# EAGLE board slaveV10a (EAGLE 6.1)
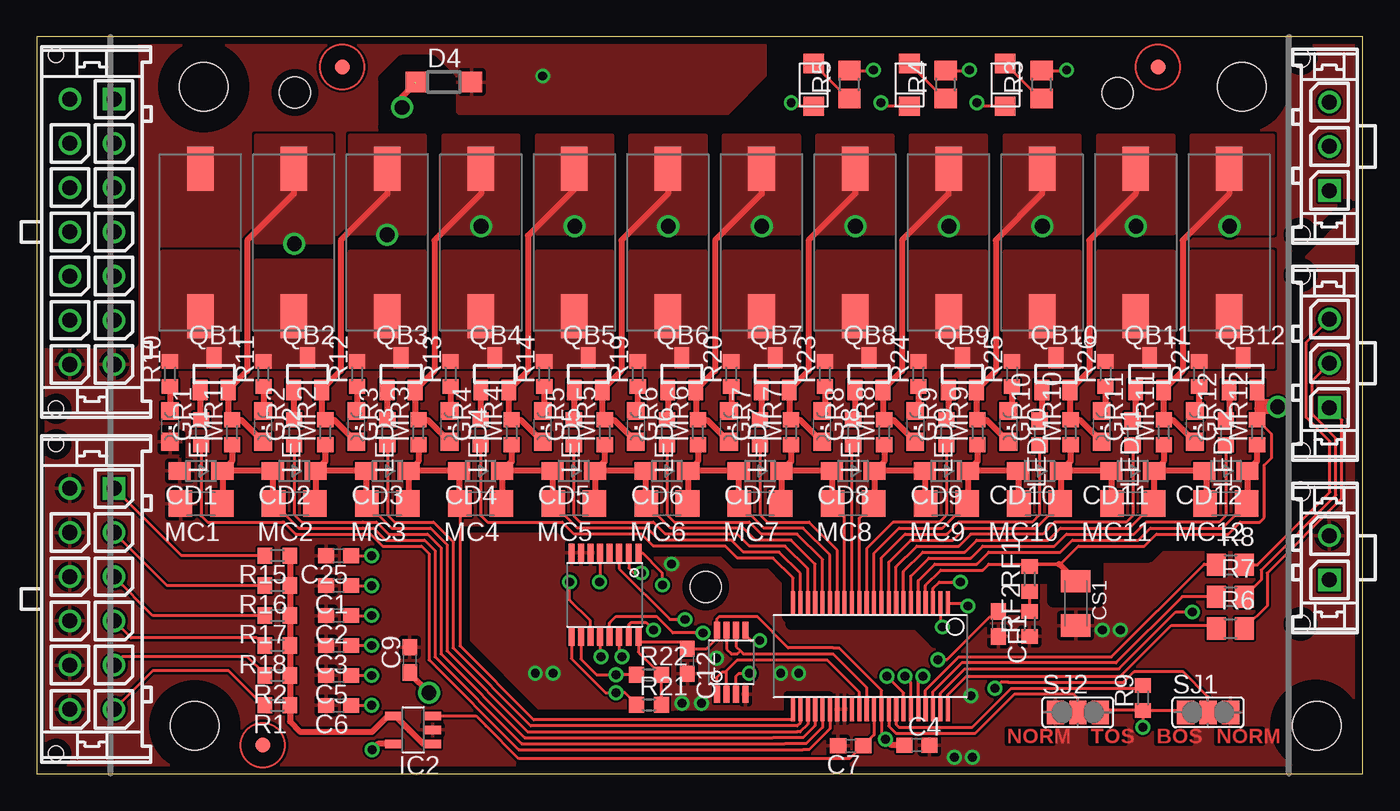
[diagram p3: board, top side]
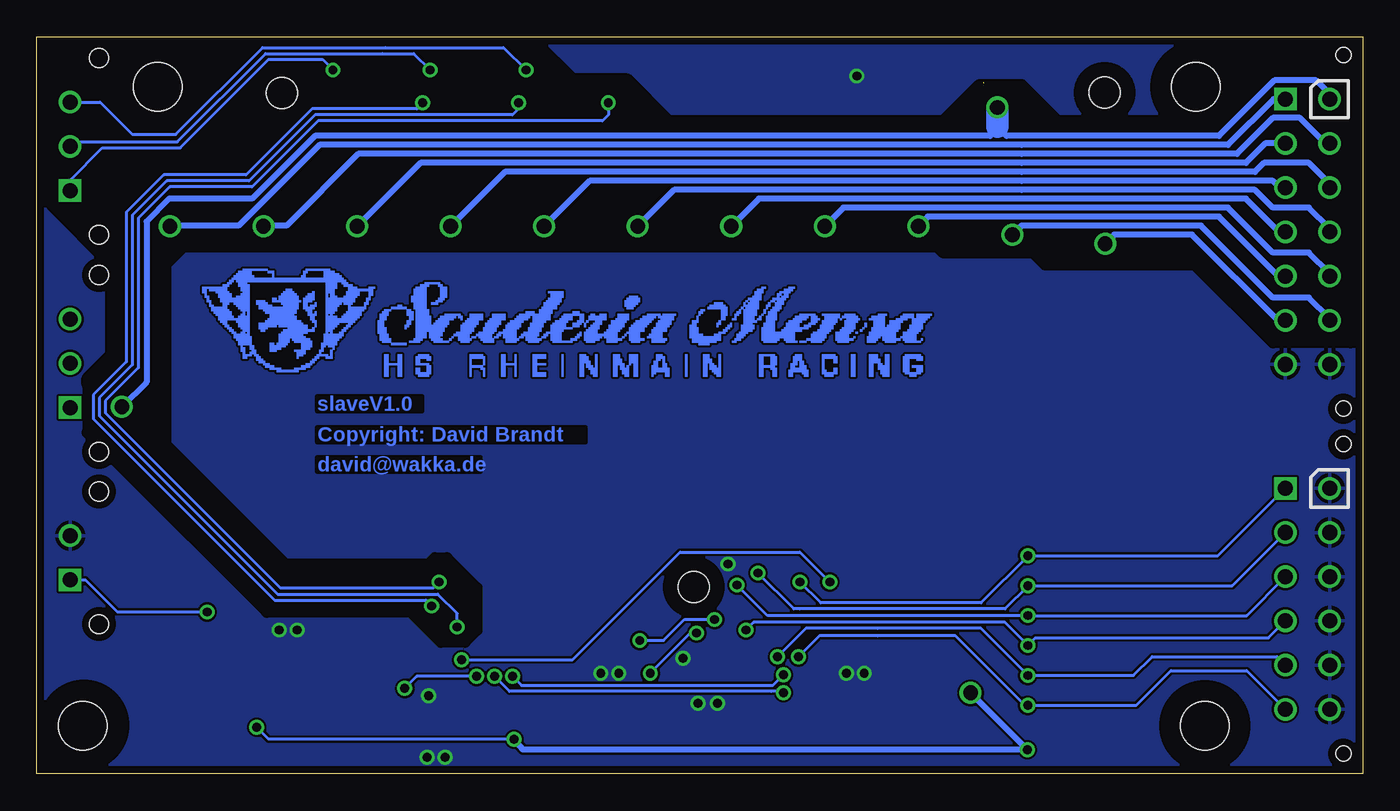
[diagram p4: board, bottom side, seen from below]

Size 90 x 50 mm. Coordinates in mm from the lower left corner, seen from the top.
Outline: 0,0 90,0 90,50 0,50 0,0
Copper layers (1*16): Top 0.035mm / dielectric 1.5mm / Bottom 0.035mm
Design rules: minimum track width 8mil, minimum drill 0.6mm, track to track 6mil, track to pad 6mil, pad to pad 6mil, via to via 6mil, smd to smd 0mil, copper to edge 20mil, drill to drill 10mil, minimum pad ring 8mil, minimum via ring 8mil, stop-mask expansion 0mil, vias tented up to drill 0mil, thermal gap 10mil
Holes 3.3 mm at 11.33,46.61 10.72,3.25 81.8,46.61 86.88,3.25
Holes 2.1 mm at 73.36,46.2 17.52,46.21 45.41,12.67
tRestrict: area 7.7,0.3 to 13.7,6.3; area 8.3,43.6 to 14.3,49.6; area 71.9,44.7 to 74.9,47.7; area 16,44.7 to 19,47.7; area 78.9,43.6 to 84.9,49.6; area 83.8,0.3 to 89.8,6.3; area 43.9,11.2 to 46.9,14.2; 59 lines
bRestrict: area 7.7,0.3 to 13.7,6.3; area 8.3,43.6 to 14.3,49.6; area 71.4,44.2 to 75.4,48.2; area 15.5,44.2 to 19.5,48.2; area 78.9,43.6 to 84.9,49.6; area 83.8,0.3 to 89.8,6.3; area 43.4,10.7 to 47.4,14.7; 35 lines

## Footprints (pad centres in the part's own frame; a part is rotated, then mirrored left to right if it is on the bottom)
C0603 = smd 1.1 x 1: 1 -0.85,0; 2 0.85,0
SOD323-W = smd 1.5 x 1.2: A 1.45,0; C -1.45,0
C1206K = smd 1.5 x 2: 1 -1.5,0; 2 1.5,0
DO-219AB = smd 1.3 x 1.4: A -1.45,0; C 1.45,0
SOD123 = smd 1.4 x 1.4: A 1.9,0; C -1.9,0
R0603 = smd 1 x 1.1: 1 -0.85,0; 2 0.85,0
44SSOP = smd 1.6 x 0.28: 1 -3.6,5.25; 2 -3.6,4.75; 3 -3.6,4.25; 4 -3.6,3.75; 5 -3.6,3.25; 6 -3.6,2.75; 7 -3.6,2.25; 8 -3.6,1.75; 9 -3.6,1.25; 10 -3.6,0.75; 11 -3.6,0.25; 12 -3.6,-0.25; 13 -3.6,-0.75; 14 -3.6,-1.25; 15 -3.6,-1.75; 16 -3.6,-2.25; 17 -3.6,-2.75; 18 -3.6,-3.25; 19 -3.6,-3.75; 20 -3.6,-4.25; 21 -3.6,-4.75; 22 -3.6,-5.25; 23 3.6,-5.25; 24 3.6,-4.75; 25 3.6,-4.25; 26 3.6,-3.75; 27 3.6,-3.25; 28 3.6,-2.75; 29 3.6,-2.25; 30 3.6,-1.75; 31 3.6,-1.25; 32 3.6,-0.75; 33 3.6,-0.25; 34 3.6,0.25; 35 3.6,0.75; 36 3.6,1.25; 37 3.6,1.75; 38 3.6,2.25; 39 3.6,2.75; 40 3.6,3.25; 41 3.6,3.75; 42 3.6,4.25; 43 3.6,4.75; 44 3.6,5.25
SOT23-5 = smd 0.6 x 1.2: 1 -0.95,-1.306; 2 0,-1.306; 3 0.95,-1.306; 4 0.95,1.306; 5 -0.95,1.306
MS8 = smd 1.156 x 0.406: 1 -2.183,0.975; 2 -2.183,0.325; 3 -2.183,-0.325; 4 -2.183,-0.975; 5 2.183,-0.975; 6 2.183,-0.325; 7 2.183,0.325; 8 2.183,0.975
TSSOP16 = smd 1.25 x 0.406: 1 -2.845,2.275; 2 -2.845,1.625; 3 -2.845,0.975; 4 -2.845,0.325; 5 -2.845,-0.325; 6 -2.845,-0.975; 7 -2.845,-1.625; 8 -2.845,-2.275; 9 2.845,-2.275; 10 2.845,-1.625; 11 2.845,-0.975; 12 2.845,-0.325; 13 2.845,0.325; 14 2.845,0.975; 15 2.845,1.625; 16 2.845,2.275
CHIPLED_0805 = smd 1.2 x 1.2: A 0,-1.05; C 0,1.05
C1206 = smd 1.6 x 1.8: 1 -1.4,0; 2 1.4,0
SUPER-SOT3 = smd 1 x 1.4: 1 -0.95,-1.1; 2 0.95,-1.1; 3 0,1.1
R0805 = smd 1.3 x 1.5: 1 -0.95,0; 2 0.95,0
FIDUCIA-MOUNT = smd 1.016 x 1.016: P$1 0,0
SM_3 = smd 1.8 x 3: P$1 0,5; P$2 0,-5
SJ_2 = smd 1.168 x 1.6: 1 -1.524,0; 2 0,0; 3 1.524,0
43650-0315 = drill 1.02 square: 1 3,0 | drill 1.02: 2 0,0; 3 -3,0 | hole 1.27: 6,-1.96; -6,-1.96
43650-0215 = drill 1.02 square: 1 1.5,0 | drill 1.02: 2 -1.5,0 | hole 1.27: 4.5,-1.96; -4.5,-1.96
43045-1212 = drill 1.02 square: P$1 7.5,0 | drill 1.02: P$2 4.5,0; P$3 1.5,0; P$4 -1.5,0; P$5 -4.5,0; P$6 -7.5,0; P$7 7.5,3; P$8 4.5,3; P$9 1.5,3; P$10 -1.5,3; P$11 -4.5,3; P$12 -7.5,3 | hole 1.02: 10.5,3.94; -10.5,3.94
43045-1412 = drill 1.02 square: P$1 9,0 | drill 1.02: P$2 6,0; P$3 3,0; P$4 0,0; P$5 -3,0; P$6 -6,0; P$7 -9,0; P$8 9,3; P$9 6,3; P$10 3,3; P$11 0,3; P$12 -3,3; P$13 -6,3; P$14 -9,3 | hole 1.02: 12,3.94; -12,3.94

## Placement (x,y rotation side)
C1  1u  [C0603]  20.49,12.76 180 top
C2  1u  [C0603]  20.49,10.73 180 top
C3  1u  [C0603]  20.49,8.7 180 top
C4  1u  [C0603]  59.74,1.93 0 top
C5  1u  [C0603]  20.49,6.67 180 top
C6  1u  [C0603]  20.49,4.64 180 top
C7  1u  [C0603]  55.24,1.89 180 top
C9  1u  [C0603]  25.32,7.72 90 top
C12  1u  [C0603]  44.15,7.63 270 top
C25  1u  [C0603]  20.49,14.8 180 top
CD1  7.5  [SOD323-W]  11.15,20.54 180 top
CD2  7.5  [SOD323-W]  17.47,20.54 180 top
CD3  7.5  [SOD323-W]  23.8,20.54 180 top
CD4  7.5  [SOD323-W]  30.12,20.54 180 top
CD5  7.5  [SOD323-W]  36.45,20.54 180 top
CD6  7.5  [SOD323-W]  42.77,20.54 180 top
CD7  7.5  [SOD323-W]  49.09,20.54 180 top
CD8  7.5  [SOD323-W]  55.42,20.54 180 top
CD9  7.5  [SOD323-W]  61.74,20.54 180 top
CD10  7.5  [SOD323-W]  68.06,20.54 180 top
CD11  7.5  [SOD323-W]  74.39,20.54 180 top
CD12  7.5  [SOD323-W]  80.71,20.54 180 top
CF1  1u  [C0603]  65.28,10.16 270 top
CS1  1u100v  [C1206K]  70.53,11.55 270 top
D1  RS07J  [DO-219AB]  65.74,46.74 270 top
D2  RS07J  [DO-219AB]  59.23,46.74 270 top
D3  RS07J  [DO-219AB]  52.73,46.74 270 top
D4  52V  [SOD123]  27.62,46.93 0 top
GR1  3.3k  [R0603]  11.15,23.16 90 top
GR2  3.3k  [R0603]  17.47,23.16 90 top
GR3  3.3k  [R0603]  23.8,23.16 90 top
GR4  3.3k  [R0603]  30.12,23.16 90 top
GR5  3.3k  [R0603]  36.45,23.16 90 top
GR6  3.3k  [R0603]  42.77,23.16 90 top
GR7  3.3k  [R0603]  49.09,23.16 90 top
GR8  3.3k  [R0603]  55.42,23.16 90 top
GR9  3.3k  [R0603]  61.74,23.16 90 top
GR10  3.3k  [R0603]  68.06,23.16 90 top
GR11  3.3k  [R0603]  74.39,23.16 90 top
GR12  3.3k  [R0603]  80.71,23.16 90 top
IC1  LTC6803-3  [44SSOP]  56.58,7.97 270 top
IC2  LT1782  [SOT23-5]  25.55,2.97 90 top
IC3  LT6001  [MS8]  47.14,7.57 90 top
IC4  4052TSSOP  [TSSOP16]  38.56,12.14 270 top
LED1  [CHIPLED_0805]  9.04,23.57 180 top
LED2  [CHIPLED_0805]  15.37,23.57 180 top
LED3  [CHIPLED_0805]  21.69,23.57 180 top
LED4  [CHIPLED_0805]  28.01,23.57 180 top
LED5  [CHIPLED_0805]  34.34,23.57 180 top
LED6  [CHIPLED_0805]  40.66,23.57 180 top
LED7  [CHIPLED_0805]  46.99,23.57 180 top
LED8  [CHIPLED_0805]  53.31,23.57 180 top
LED9  [CHIPLED_0805]  59.63,23.57 180 top
LED10  [CHIPLED_0805]  65.96,23.57 180 top
LED11  [CHIPLED_0805]  72.28,23.57 180 top
LED12  [CHIPLED_0805]  78.6,23.57 180 top
MC1  100n  [C1206]  11.15,18.32 180 top
MC2  100n  [C1206]  17.47,18.32 180 top
MC3  100n  [C1206]  23.8,18.32 180 top
MC4  100n  [C1206]  30.12,18.32 180 top
MC5  100n  [C1206]  36.45,18.32 180 top
MC6  100n  [C1206]  42.77,18.32 180 top
MC7  100n  [C1206]  49.09,18.32 180 top
MC8  100n  [C1206]  55.42,18.32 180 top
MC9  100n  [C1206]  61.74,18.32 180 top
MC10  100n  [C1206]  68.06,18.32 180 top
MC11  100n  [C1206]  74.39,18.32 180 top
MC12  100n  [C1206]  80.71,18.32 180 top
MR1  100  [R0603]  13.26,23.16 90 top
MR2  100  [R0603]  19.58,23.16 90 top
MR3  100  [R0603]  25.91,23.16 90 top
MR4  100  [R0603]  32.23,23.16 90 top
MR5  100  [R0603]  38.55,23.16 90 top
MR6  100  [R0603]  44.88,23.16 90 top
MR7  100  [R0603]  51.2,23.16 90 top
MR8  100  [R0603]  57.52,23.16 90 top
MR9  100  [R0603]  63.85,23.16 90 top
MR10  100  [R0603]  70.17,23.16 90 top
MR11  100  [R0603]  76.5,23.16 90 top
MR12  100  [R0603]  82.83,23.16 90 top
QB1  PMV65XP  [SUPER-SOT3]  12.03,27.13 0 top
QB2  PMV65XP  [SUPER-SOT3]  18.38,27.13 0 top
QB3  PMV65XP  [SUPER-SOT3]  24.73,27.13 0 top
QB4  PMV65XP  [SUPER-SOT3]  31.08,27.13 0 top
QB5  PMV65XP  [SUPER-SOT3]  37.43,27.13 0 top
QB6  PMV65XP  [SUPER-SOT3]  43.78,27.13 0 top
QB7  PMV65XP  [SUPER-SOT3]  50.13,27.13 0 top
QB8  PMV65XP  [SUPER-SOT3]  56.48,27.13 0 top
QB9  PMV65XP  [SUPER-SOT3]  62.83,27.13 0 top
QB10  PMV65XP  [SUPER-SOT3]  69.18,27.13 0 top
QB11  PMV65XP  [SUPER-SOT3]  75.53,27.13 0 top
QB12  PMV65XP  [SUPER-SOT3]  81.88,27.13 0 top
R1  10k0.1%  [R0603]  16.33,4.64 180 top
R2  10k0.1%  [R0603]  16.33,6.67 180 top
R3  100  [R0805]  68.21,46.77 90 top
R4  20  [R0805]  61.69,46.77 90 top
R5  100  [R0805]  55.17,46.77 90 top
R6  100  [R0805]  81.03,9.86 0 top
R7  20  [R0805]  81.03,12.01 0 top
R8  100  [R0805]  81.03,14.17 0 top
R9  1M  [R0603]  75.08,5.14 90 top
R10  470  [R0603]  9.04,27.13 90 top
R11  470  [R0603]  15.39,27.13 90 top
R12  470  [R0603]  21.74,27.13 90 top
R13  470  [R0603]  28.09,27.13 90 top
R14  470  [R0603]  34.44,27.13 90 top
R15  10k0.1%  [R0603]  16.33,14.8 180 top
R16  10k0.1%  [R0603]  16.33,12.76 180 top
R17  10k0.1%  [R0603]  16.33,10.73 180 top
R18  10k0.1%  [R0603]  16.33,8.7 180 top
R19  470  [R0603]  40.79,27.13 90 top
R20  470  [R0603]  47.14,27.13 90 top
R21  47k  [R0603]  41.55,4.67 0 top
R22  47k  [R0603]  41.55,6.71 0 top
R23  470  [R0603]  53.49,27.13 90 top
R24  470  [R0603]  59.84,27.13 90 top
R25  470  [R0603]  66.19,27.13 90 top
R26  470  [R0603]  72.54,27.13 90 top
R27  470  [R0603]  78.89,27.13 90 top
REF1  FIDUCIALMOUNT  [FIDUCIA-MOUNT]  20.73,47.96 0 top
REF2  FIDUCIALMOUNT  [FIDUCIA-MOUNT]  76.1,47.96 0 top
REF3  FIDUCIALMOUNT  [FIDUCIA-MOUNT]  15.34,1.93 0 top
RF1  332k0.1%  [R0603]  67.39,13.21 90 top
RF2  20k0.1%  [R0603]  67.39,10.16 90 top
RP1  10  [SM_3]  11.09,36.04 0 top
RP2  10  [SM_3]  17.44,36.04 0 top
RP3  10  [SM_3]  23.79,36.04 0 top
RP4  10  [SM_3]  30.14,36.04 0 top
RP5  10  [SM_3]  36.49,36.04 0 top
RP6  10  [SM_3]  42.84,36.04 0 top
RP7  10  [SM_3]  49.19,36.04 0 top
RP8  10  [SM_3]  55.54,36.04 0 top
RP9  10  [SM_3]  61.89,36.04 0 top
RP10  10  [SM_3]  68.24,36.04 0 top
RP11  10  [SM_3]  74.59,36.04 0 top
RP12  10  [SM_3]  80.94,36.04 0 top
SJ1  [SJ_2]  79.5,4.17 0 top
SJ2  [SJ_2]  70.66,4.17 0 top
U$7  [SMLOGO]  67.87,30.07 0 bottom
X1  [43650-0315]  87.74,42.57 270 top
X2  [43650-0315]  87.74,27.84 270 top
X3  [43650-0215]  87.74,14.65 270 top
X4  [43045-1212]  5.25,11.87 90 top
X5  [43045-1412]  5.25,36.77 90 top

## Tracks (layer width: path | path; a pad name or v marks a point on that pad's centre or on a via)
+5V  (via drill 0.6, 1)
  Top 0.203: 57.33,2.57 IC1.35 57.33,5.66 55.27,7.72 54.46,8.53 54.05,8.53 51,8.53 48.87,10.67 48.77,10.67 46.33,10.67 46.17,10.51 IC3.8 46.17,9.19 45.92,8.94 45.47,8.48 C12.1 43.7,8.94 40.84,8.94 40.84,9.04 40.95,9.14 40.83,9.26 IC4.16 40.83,8.24 40.95,8.13 42.37,6.71 R22.2 R21.2 | 57.33,2.57 v57.61,2.34 57.33,2.57 | R9.1 77.85,4.29 SJ1.1 | R9.1 72.31,4.29 SJ2.3 | R9.1 v75.08,3.15
  Top 0.406: IC2.5 23.15,2.02 v22.76,1.63 | C9.1 25.32,6.79 v26.62,5.49 | C4.1 58.01,1.93 v57.61,2.34
  Bottom 0.203: v57.61,2.34 70.81,2.34 74.27,2.34 v75.08,3.15
  Bottom 0.406: v26.62,5.49 v22.76,1.63 57,1.63 v57.61,2.34
B1
  pour Top (no thermals): 8.55,35.41 8.55,27.6 13.63,27.6 13.63,35.41
B2
  pour Top (no thermals): 14.9,34.8 14.9,27.6 19.98,27.6 19.98,34.8
B3
  pour Top (no thermals): 21.25,35.41 21.25,27.6 26.33,27.6 26.33,35.41
B4
  pour Top (no thermals): 27.6,35.41 27.6,27.6 32.68,27.6 32.68,35.41
B5
  pour Top (no thermals): 33.95,35.41 33.95,27.6 39.03,27.6 39.03,35.41
B6
  pour Top (no thermals): 40.3,35.41 40.3,27.6 45.38,27.6 45.38,35.41
B7
  pour Top (no thermals): 46.65,35.41 46.65,27.6 51.73,27.6 51.73,35.41
B8
  pour Top (no thermals): 53,35.41 53,27.6 58.08,27.6 58.08,35.41
B9
  pour Top (no thermals): 59.35,35.41 59.35,27.6 64.43,27.6 64.43,35.41
B10
  pour Top (no thermals): 65.7,35.41 65.7,27.6 70.78,27.6 70.78,35.41
B11
  pour Top (no thermals): 72.05,35.41 72.05,27.6 77.13,27.6 77.13,35.41
B12
  pour Top (no thermals): 78.4,35.41 78.4,27.6 83.89,27.6 83.89,35.41
C1  (via drill 1)
  Top 0.406: RP2.P$1 17.44,39.35 14.29,36.2 14.29,27.33 QB1.2 12.98,24.29 MR1.2 13.87,24.02 LED2.C
  Bottom 0.406: X5.P$6 5.77,30.77 11.58,36.58 16.87,36.58 v17.48,35.97
  pour Top (no thermals): 14.9,43.28 14.9,36.07 19.98,36.07 19.98,43.28
C1M
  Top 0.203: MC2.2 16.07,18.27 16.18,18.27 17.78,16.66 22.15,16.66 22.86,16.66 23.67,15.85 26.31,15.85 27.03,15.14 27.03,7.92 32.92,2.03 50.8,2.03 52.22,2.03 53.33,3.14 IC1.27
  Top 0.406: MR1.1 13.26,21.2 CD1.C | CD1.C 12.6,18.37 MC1.1 | MC2.2 16.02,18.37 CD2.A CD1.C
C2  (via drill 1)
  Top 0.406: RP3.P$1 23.79,39.35 20.64,36.2 20.64,27.33 QB2.2 19.33,24.27 MR2.2 20.2,24.02 LED3.C
  Bottom 0.406: X5.P$13 2.25,30.9 3.66,32.31 6.1,32.31 10.97,37.19 17.68,37.19 23.16,37.19 v23.77,36.58
  pour Top (no thermals): 21.25,43.28 21.25,36.68 26.33,36.68 26.33,43.28
C2M
  Top 0.203: MC3.2 22.42,18.32 24.08,16.66 26.72,16.66 27.84,15.54 27.84,8.33 33.33,2.85 51.61,2.85 51.82,2.85 52.33,3.36 IC1.25
  Top 0.406: MR2.1 19.58,21.2 CD2.C | CD2.C 18.92,18.37 MC2.1 | CD2.C CD3.A 22.35,18.37 MC3.2
C3  (via drill 1)
  Top 0.406: RP4.P$1 30.14,39.35 26.99,36.2 26.99,27.33 QB3.2 25.68,24.24 MR3.2 26.52,24.02 LED4.C
  Bottom 0.406: X5.P$5 5.72,33.77 9.75,37.8 24.99,37.8 29.52,37.8 v30.16,37.15
  pour Top (no thermals): 27.6,43.28 27.6,36.68 32.68,36.68 32.68,43.28
C3M
  Top 0.203: MC4.2 28.72,8.67 33.73,3.66 51.21,3.66 51.33,3.79 IC1.23
  Top 0.406: CD3.C CD4.A 28.67,18.37 MC4.2 | MR3.1 25.91,21.2 CD3.C | CD3.C 25.25,18.37 MC3.1
C4  (via drill 1)
  Top 0.406: RP5.P$1 36.49,39.67 33.34,36.51 33.34,27.33 QB4.2 32.03,24.21 MR4.2 32.84,24.02 LED5.C
  Bottom 0.406: X5.P$12 2.25,33.95 3.66,35.36 6.1,35.36 9.14,38.41 23.16,38.41 35.26,38.41 v36.51,37.15
  pour Top (no thermals): 33.95,43.28 33.95,36.68 39.03,36.68 39.03,43.28
C4M
  Top 0.203: IC1.21 51.83,13.6 50.39,15.04 47.95,15.04 47.14,15.85 42.27,15.85 41.45,16.66 36.7,16.66 MC5.2
  Top 0.406: CD4.C 31.57,18.37 MC4.1 | MR4.1 32.23,21.2 CD4.C | CD4.C CD5.A 35,18.37 MC5.2
C5  (via drill 1)
  Top 0.406: RP6.P$1 42.84,39.35 39.69,36.2 39.69,27.33 QB5.2 38.38,24.19 MR5.2 39.17,24.02 LED6.C
  Bottom 0.406: X5.P$4 5.68,36.77 7.92,39.01 23.16,39.01 41,39.01 v42.86,37.15
  pour Top (no thermals): 40.3,43.28 40.3,36.68 45.38,36.68 45.38,43.28
C5M
  Top 0.203: IC1.19 52.83,14.22 51.21,15.85 48.77,15.85 47.95,16.66 43.02,16.66 MC6.2
  Top 0.406: MR5.1 38.55,21.2 CD5.C | CD5.C 37.9,18.37 MC5.1 | MC6.2 41.32,18.37 CD6.A CD5.C
C6  (via drill 1)
  Top 0.406: RP7.P$1 49.19,39.35 46.04,36.2 46.04,27.33 QB6.2 44.73,24.16 MR6.2 45.49,24.02 LED7.C
  Bottom 0.406: X5.P$11 2.25,36.99 3.66,38.41 6.1,38.41 7.32,39.62 23.16,39.62 46.74,39.62 v49.21,37.15
  pour Top (no thermals): 46.65,43.28 46.65,36.68 51.73,36.68 51.73,43.28
C6M
  Top 0.203: IC1.17 53.83,14.85 52.02,16.66 49.35,16.66 MC7.2
  Top 0.406: CD6.C 44.22,18.37 MC6.1 | MR6.1 44.88,21.2 CD6.C | CD6.C CD7.A 47.64,18.37 MC7.2
C7  (via drill 1)
  Top 0.406: RP8.P$1 55.54,39.35 52.39,36.2 52.39,27.33 QB7.2 51.08,24.14 MR7.2 51.81,24.02 LED8.C
  Bottom 0.406: X5.P$3 5.63,39.77 6.1,40.23 23.16,40.23 52.48,40.23 v55.56,37.15
  pour Top (no thermals): 53,43.28 53,36.68 58.08,36.68 58.08,43.28
C7M
  Top 0.203: IC1.15 54.83,17.5 MC8.2
  Top 0.406: CD7.C 50.54,18.37 MC7.1 | MR7.1 51.2,21.2 CD7.C | CD7.C CD8.A 53.97,18.37 MC8.2
C8  (via drill 1)
  Top 0.406: RP9.P$1 61.89,39.35 58.74,36.2 58.74,27.33 QB8.2 57.43,24.11 MR8.2 58.14,24.02 LED9.C
  Bottom 0.406: X5.P$10 2.25,40.04 3.66,41.45 6.71,41.45 7.32,40.84 23.16,40.84 58.22,40.84 v61.91,37.15
  pour Top (no thermals): 59.35,43.28 59.35,36.68 64.43,36.68 64.43,43.28
C8M
  Top 0.203: IC1.13 55.83,17.34 MC8.1
  Top 0.406: MR8.1 57.52,21.2 CD8.C | CD8.C 56.87,18.37 MC8.1 | CD8.C CD9.A 60.29,18.37 MC9.2
C9  (via drill 1)
  Top 0.406: RP10.P$1 68.24,39.35 65.09,36.2 65.09,27.33 QB9.2 63.78,24.08 MR9.2 64.46,24.02 LED10.C
  Bottom 0.406: X5.P$2 6.61,42.77 7.92,41.45 23.16,41.45 63.96,41.45 v68.26,37.15
  pour Top (no thermals): 65.7,43.28 65.7,36.68 70.78,36.68 70.78,43.28
C9M
  Top 0.203: IC1.11 56.83,14.97 58.52,16.66 61.48,16.66 MC9.1
  Top 0.406: CD9.C 63.19,18.37 MC9.1 | MR9.1 63.85,21.2 CD9.C | CD9.C CD10.A 66.61,18.37 MC10.2
C10  (via drill 1)
  Top 0.406: RP11.P$1 74.59,39.35 71.44,36.2 71.44,27.33 QB10.2 70.13,24.06 MR10.2 70.79,24.02 LED11.C
  Bottom 0.406: X5.P$9 2.53,42.77 3.66,43.89 4.27,44.5 6.1,44.5 8.53,42.06 23.16,42.06 68.17,42.06 73.05,37.19 74.57,37.19 v74.61,37.15
  pour Top (no thermals): 72.05,43.28 72.05,36.68 77.13,36.68 77.13,43.28
C10M
  Top 0.203: IC1.9 57.83,14.35 59.33,15.85 62.18,15.85 62.99,16.66 67.81,16.66 MC10.1
  Top 0.406: MR10.1 70.17,21.2 CD10.C | CD10.C CD11.A 72.94,18.37 MC11.2 | CD10.C 69.51,18.37 MC10.1
C11  (via drill 1)
  Top 0.406: RP12.P$1 80.94,39.35 77.79,36.2 77.79,27.33 QB11.2 76.48,24.03 MR11.2 77.11,24.02 LED12.C
  Bottom 0.406: X5.P$1 6.05,45.77 9.14,42.67 23.16,42.67 70.81,42.67 76.3,37.19 80.92,37.19 v80.96,37.15
  pour Top (no thermals): 78.4,43.28 78.4,36.68 83.89,36.68 83.89,43.28
C11M
  Top 0.203: IC1.7 58.83,13.72 60.15,15.04 62.99,15.04 63.8,15.85 68.68,15.85 69.49,16.66 74.17,16.66 74.88,17.37 75.79,18.28 MC11.1
  Top 0.406: MR11.1 76.5,21.2 CD11.C | CD11.C 75.84,18.37 MC11.1 | CD11.C CD12.A 79.26,20.11 79.38,20 79.38,18.38 MC12.2
C12  (via drill 1)  (1 unrouted)
  Top 0.203: IC1.4 60.33,12.79 61.37,13.82 64.21,13.82 64.62,14.22 67.46,14.22 69.39,14.22 | 69.39,14.22 69.49,14.22 70.71,15.44 75.18,15.44 76,16.26 80.87,16.26 81.69,17.07 83.01,17.07 83.31,17.37 83.31,20.93 83.82,21.44 83.82,23.02 MR12.2 | 83.21,24.89 82.96,24.89 82.83,24.77 | 69.39,14.22 67.55,14.22
  Top 0.406: QB12.2 82.83,24.77 MR12.2 | 25.72,46.85 24.79,45.92 v24.79,45.21 | CS1.1 69.41,14.21 69.39,14.22 | RF1.2 67.46,14.06 67.46,14.22
  Top 1.016: v84.23,24.89 83.21,24.89
  Bottom 0.406: X5.P$8 2.25,46.14 3.05,46.94 3.15,47.04 5.99,47.04 9.75,43.28 24.18,43.28 24.79,43.89 24.79,43.79 25.3,43.28 71.12,43.28 75.39,39.01 81,39.01 82.55,37.47 82.55,26.57 v84.23,24.89
  Bottom 1.524: 24.79,43.89 v24.79,45.21
C12M
  Top 0.203: IC1.5 59.83,13.1 60.96,14.22 63.8,14.22 64.62,15.04 69.49,15.04 70.31,15.85 74.78,15.85 75.59,16.66 80.46,16.66 MC12.1
  Top 0.406: MC12.1 82.16,18.37 CD12.C 82.83,21.21 MR12.1
CSBB
  Top 0.203: IC1.44 61.83,5.34 62.59,6.1 63.09,6.6 73.56,6.6 77.01,10.06 79.87,10.06 R6.1
CSBBP
  Top 0.203: X2.1 88.59,23.99 88.59,18.69 83.52,13.61 83.52,11.39 R6.2
CSBT  (via drill 0.6)
  Top 0.203: D1.C 64.04,45.29 v63.8,45.52 | IC1.1 62.98,11.57 v63.2,11.38
  Bottom 0.203: v63.8,45.52 64.21,45.11 71.32,45.11 75.79,40.64 81.38,40.64 83.92,38.1 83.92,27.94 86.16,25.7 86.16,24.08 73.86,11.79 63.6,11.79 v63.2,11.38
CSBTK
  Top 0.203: R3.1 68.11,45.81 D1.A
CSBTP  (via drill 0.6)
  Top 0.203: R3.2 69.86,47.72 v69.9,47.75
  Bottom 0.203: X1.1 87.74,40.27 85.55,42.47 80.26,42.47 74.37,48.36 74.27,48.46 70.61,48.46 v69.9,47.75
FSM  (via drill 0.6)
  Top 0.203: RF1.1 RF2.2 CF1.1 65.23,10.57 65.33,10.6 64.66,10.6 61.77,7.72 v61.16,7.72 | IC4.11 37.58,10.37 36.17,11.79 v36.17,13.01
  Bottom 0.203: v36.17,13.01 38.2,15.04 46.33,15.04 53.65,7.72 v61.16,7.72
GND  (via drill 0.6)
  other vias: 46.13,7.82 43.79,4.78 45.11,4.78 50.5,6.81 51.71,6.81 43.08,14.22 34.34,47.35 72.34,9.75 73.56,9.75 63.4,5.28 33.83,6.81 35.05,6.81 62.28,1.12 63.5,1.12
  pour Top (rank 6): 0,0 90,0 90,50 0,50
  pour Bottom (rank 6): 0,0 90,0 90,50 0,50
  pour Top (no thermals): 8.45,43.38 13.74,43.38 13.74,38.51 8.45,38.51
GPIO1  (via drill 0.6)
  Top 0.203: IC4.10 36.93,7.77 38,6.71 v39.32,6.71 R22.1 | IC1.38 58.83,5.48 v57.71,6.6
  Bottom 0.203: v57.71,6.6 57.1,5.99 40.03,5.99 v39.32,6.71
GPIO2  (via drill 0.6)
  Top 0.203: IC4.9 36.28,7.81 38.41,5.69 38.61,5.49 v39.32,5.49 39.93,5.49 40.7,4.71 R21.1 | IC1.39 59.33,6.2 v58.93,6.6
  Bottom 0.203: v39.32,5.49 39.32,5.59 40.13,5.59 57.91,5.59 v58.93,6.6
L1C
  Top 0.406: R10.1 LED1.A
L2C
  Top 0.406: R11.1 15.39,24.75 LED2.A
L3C
  Top 0.406: R12.1 21.74,24.78 LED3.A
L4C
  Top 0.406: R13.1 28.09,24.81 LED4.A
L5C
  Top 0.406: R14.1 34.44,24.83 LED5.A
L6C
  Top 0.406: R19.1 40.79,24.86 LED6.A
L7C
  Top 0.406: R20.1 47.14,24.89 LED7.A
L8C
  Top 0.406: R23.1 53.49,24.91 LED8.A
L9C
  Top 0.406: R24.1 59.84,24.94 LED9.A
L10C
  Top 0.406: R25.1 66.19,24.96 LED10.A
L11C
  Top 0.406: R26.1 72.54,24.99 LED11.A
L12C
  Top 0.406: R27.1 78.89,25.02 LED12.A
MUX1  (via drill 0.6)
  Top 0.203: IC3.3 47.47,6.62 47.65,6.81 v48.36,6.81 | v45.21,9.55 43.18,9.55 42.06,10.67 39.32,10.67 38.88,10.23 IC4.13
  Bottom 0.203: v48.36,6.81 45.62,9.55 v45.21,9.55
MUX2  (via drill 0.6)
  Top 0.203: IC3.5 48.12,9.39 48.46,9.04 v49.07,9.04 | IC4.3 39.53,13.91 42.98,10.46 v43.99,10.46
  Bottom 0.203: v49.07,9.04 47.45,9.04 46.02,10.46 v43.99,10.46
S1
  Top 0.203: GR1.1 11.15,17.5 11.58,17.07 16.66,17.07 16.76,17.07 17.58,16.26 22.15,16.26 22.66,16.26 23.47,15.44 26.11,15.44 26.62,14.94 26.62,7.72 32.72,1.63 52.02,1.63 52.43,1.63 53.83,3.03 IC1.28
S1G
  Top 0.406: QB1.1 11.08,24.08 GR1.2
S1G1
  Top 0.406: QB2.1 17.43,24.06 GR2.2
S1G2
  Top 0.406: QB3.1 23.78,24.03 GR3.2
S1G3
  Top 0.406: QB4.1 30.13,24.02 GR4.2
S1G4
  Top 0.406: QB5.1 36.48,24.05 GR5.2
S1G5
  Top 0.406: QB6.1 42.83,24.08 GR6.2
S1G6
  Top 0.406: QB7.1 49.18,24.1 GR7.2
S1G7
  Top 0.406: QB8.1 55.53,24.13 GR8.2
S1G8
  Top 0.406: QB9.1 61.88,24.16 GR9.2
S1G9
  Top 0.406: QB10.1 68.23,24.18 GR10.2
S1G10
  Top 0.406: QB11.1 74.58,24.21 GR11.2
S1G11
  Top 0.406: QB12.1 80.93,24.23 GR12.2
S2
  Top 0.203: GR2.1 17.47,17.58 17.98,17.07 22.15,17.07 23.06,17.07 23.88,16.26 26.52,16.26 27.43,15.34 27.43,8.13 33.12,2.44 49.99,2.44 52.02,2.44 52.83,3.25 IC1.26
S3
  Top 0.203: GR3.1 23.8,17.55 24.28,17.07 26.92,17.07 28.25,15.75 28.25,8.53 33.53,3.25 51.61,3.25 51.83,3.47 IC1.24
S4
  Top 0.203: IC1.22 51.33,13.28 49.99,14.63 47.55,14.63 46.74,15.44 41.86,15.44 41.05,16.26 36.47,16.26 35.66,17.07 30.58,17.07 30.12,17.53 GR4.1
S5
  Top 0.203: IC1.20 52.33,13.91 50.8,15.44 48.36,15.44 47.55,16.26 42.67,16.26 41.86,17.07 36.88,17.07 36.45,17.5 GR5.1
S6
  Top 0.203: IC1.18 53.33,14.54 51.61,16.26 49.17,16.26 48.36,17.07 43.28,17.07 42.77,17.58 GR6.1
S7
  Top 0.203: IC1.16 54.33,15.16 52.43,17.07 49.58,17.07 49.09,17.56 GR7.1
S8
  Top 0.203: IC1.14 55.33,22.23 GR8.1
S9
  Top 0.203: IC1.12 56.33,15.29 58.12,17.07 61.27,17.07 61.74,17.55 GR9.1
S10
  Top 0.203: IC1.10 57.33,14.66 58.93,16.26 61.77,16.26 62.59,17.07 67.56,17.07 68.06,17.57 GR10.1
S11
  Top 0.203: IC1.8 58.33,14.04 59.74,15.44 62.59,15.44 63.4,16.26 68.28,16.26 69.09,17.07 73.97,17.07 74.39,17.49 GR11.1
S12
  Top 0.203: IC1.6 59.33,13.41 60.55,14.63 63.4,14.63 64.21,15.44 69.09,15.44 69.9,16.26 74.47,16.26 75.29,17.07 80.26,17.07 80.71,17.52 GR12.1
SCKB
  Top 0.203: IC1.41 60.33,5.67 62.59,7.92 72.95,7.92 79.25,14.22 80.03,14.22 R8.1
SCKBP
  Top 0.203: X2.3 86.16,29.26 86.16,24.18 87.78,22.55 87.78,19.1 82.86,14.17 R8.2
SCKT  (via drill 0.6)
  Top 0.203: D3.C 51.44,45.29 v51.21,45.52 | IC1.3 60.83,12.57 61.27,13.01 v62.69,13.01
  Bottom 0.203: v51.21,45.52 51.21,44.7 51.61,44.3 70.92,44.3 75.39,39.83 80.97,39.83 83.11,37.69 83.11,27.53 85.34,25.3 85.34,24.49 73.46,12.6 63.09,12.6 v62.69,13.01
SCKTK
  Top 0.203: R5.1 55.1,45.81 D3.A
SCKTP  (via drill 0.6)
  Top 0.203: R5.2 56.76,47.72 v56.79,47.75
  Bottom 0.203: X1.3 85.7,45.57 83.52,43.38 80.57,43.38 74.68,49.28 66.34,49.28 58.32,49.28 v56.79,47.75
SDIB
  Top 0.203: IC1.42 60.83,5.56 62.79,7.52 73.25,7.52 77.75,12.01 R7.1
SDIBP
  Top 0.203: X2.2 86.56,26.67 86.56,24.38 86.67,24.28 88.19,22.76 88.19,18.9 83.11,13.82 83.11,13.15 R7.2
SDOB  (via drill 0.6)
  Top 0.203: IC1.43 61.33,5.45 62.99,7.11 73.46,7.11 77.32,10.97 v78.44,10.97
  Bottom 0.203: X3.1 86.71,13.15 84.53,10.97 v78.44,10.97
SDOT  (via drill 0.6)
  Top 0.203: D2.C 57.53,45.29 v57.3,45.52 | IC1.2 61.33,10.09 v61.47,9.96
  Bottom 0.203: v57.3,45.52 57.3,45.11 57.71,44.7 71.12,44.7 75.59,40.23 81.18,40.23 83.52,37.9 83.52,27.74 85.75,25.5 85.75,24.28 73.66,12.19 62.79,12.19 61.47,10.87 v61.47,9.96
SDOTK
  Top 0.203: R4.1 61.6,45.81 D2.A
SDOTP  (via drill 0.6)
  Top 0.203: R4.2 63.26,47.72 v63.3,47.75
  Bottom 0.203: X1.2 87.74,42.61 87.48,42.88 80.47,42.88 74.47,48.87 66.55,48.87 64.41,48.87 v63.3,47.75
TOS
  Top 0.203: IC1.36 57.83,3.23 58.32,2.74 63.7,2.74 64.82,3.86 66.34,5.38 70.41,5.38 70.66,5.13 SJ2.2
TSM1  (via drill 0.6)
  Top 0.203: R15.2 9.82,14.8 X4.P$1 | C25.1 v22.73,14.8 | IC4.5 38.23,13.04 v38.2,13.01
  Bottom 0.203: X4.P$1 9.82,14.8 v22.73,14.8 22.73,14.76 25.91,11.58 36.78,11.58 v38.2,13.01
TSM2  (via drill 0.6)
  Top 0.203: R16.2 8.85,12.76 X4.P$2 | C1.1 v22.73,12.76 | IC4.2 40.18,13.97 40.54,13.61 v41.05,13.61
  Bottom 0.203: X4.P$2 8.85,12.76 v22.73,12.76 22.73,12.72 24.28,11.18 38.2,11.18 38.61,11.18 v41.05,13.61
TSM3  (via drill 0.6)
  Top 0.203: R17.2 7.88,10.73 X4.P$3 | C2.1 v22.73,10.73 | IC4.1 41.1,14.98 42.27,13.82 42.47,13.61 v42.47,12.8
  Bottom 0.203: X4.P$3 7.88,10.73 v22.73,10.73 38.37,10.73 40.4,10.73 v42.47,12.8
TSM4  (via drill 0.6)
  Top 0.203: R18.2 15.43,8.7 14.92,9.21 6.41,9.21 X4.P$4 | C3.1 v22.73,8.7 | IC4.15 40.18,10.11 40.34,10.26 41.35,10.26 v41.86,9.75
  Bottom 0.203: X4.P$4 6.41,9.21 22.23,9.21 v22.73,8.7 22.73,8.71 24.28,10.26 41.35,10.26 v41.86,9.75
TSM5  (via drill 0.6)
  Top 0.203: R1.2 15.37,4.64 13.02,6.99 7.87,6.99 X4.P$6 | C6.1 v22.73,4.64 | IC4.12 38.23,8 v38.3,7.92
  Bottom 0.203: X4.P$6 7.87,6.99 13.02,6.99 15.37,4.64 v22.73,4.64 22.92,4.64 27.64,9.35 32.92,9.35 36.88,9.35 v38.3,7.92
TSM6  (via drill 0.6)
  Top 0.203: R2.2 15.48,6.74 14.29,7.94 5.82,7.94 X4.P$5 | C5.1 v22.73,6.67 | IC4.14 39.53,8.12 v39.73,7.92
  Bottom 0.203: X4.P$5 5.82,7.94 14.29,7.94 15.56,6.67 v22.73,6.67 v22.73,6.68 25.91,9.86 32.92,9.86 37.8,9.86 v39.73,7.92
VMODE  (via drill 0.6)
  Top 0.203: SJ1.2 79.5,5.23 77.83,6.91 74.47,6.91 73.76,6.2 73.56,6.2 65.94,6.2 65.43,6.2 v65.02,5.79 | IC1.40 59.83,6.29 v60.15,6.6
  Bottom 0.203: v60.15,6.6 64.21,6.6 v65.02,5.79
VREF
  Top 0.203: IC1.34 56.83,2.63 C7.1 56.05,1.89 55.17,1.02 32.72,1.02 30.48,3.25 29.81,3.92 IC2.3
VREFP
  Top 0.406: R15.1 R16.1 R17.1 R18.1 R2.1 R1.1 17.18,3.54 17.88,2.85 22.76,2.85 23.83,3.92 IC2.4 24.33,3.92 25.3,2.95 26.23,2.02 IC2.1
VTEMP1
  Top 0.203: IC3.2 46.82,6.99 | 46.82,6.99 47.55,7.72 53.65,7.72 55.27,6.1 55.83,5.53 IC1.32 | IC3.1 46.17,6.54 46.53,6.91 46.74,6.91 46.82,6.99
VTEMP2
  Top 0.203: IC3.6 47.47,8.62 47.75,8.33 | 47.75,8.33 47.95,8.13 54.05,8.13 55.68,6.5 56.33,5.85 IC1.33 | IC3.7 46.82,8.45 47.14,8.13 47.55,8.13 47.75,8.33
WDTB
  Top 0.203: IC1.37 58.33,3.34 58.52,3.15 63.5,3.15 65.63,5.28 66.14,5.79 73.56,5.79 74.89,5.79 R9.2

## Text on the board
Top: NORM | TOS | BOS | NORM
Bottom: slaveV1.0 | Copyright: David Brandt | david@wakka.de
tDocu: Licensed under: CC BY-NC-SA 3.0 | You are free: | to Share - to copy, distribute and transmit the work | to Remix - to adapt the work | Under the following conditions: | Attribution - You must attribute the work in the manner specified by | the author or licensor (but not in any way that suggests that | they endorse you or your use of the work). | Noncommercial - You may not use this work for commercial purposes. | Share Alike - If you alter, transform, or build upon this work, you may | distribute the resulting work only under the same or similar license | to this one. | Full License: http://creativecommons.org/licenses/by-nc-sa/3.0/ or on Page 2 of Schematic | Copyright (C) 2012 David Brandt